# Altium schematic sheet Sche.SchDoc
size A; SheetNumber: 1; SheetTotal: 1
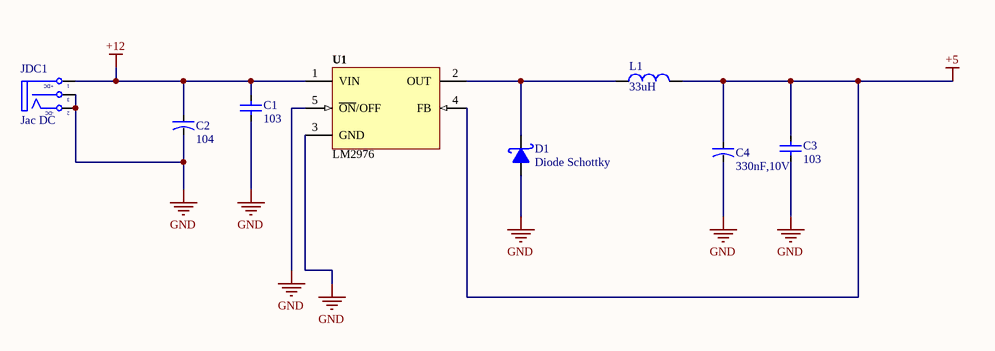
[diagram p0: Sche.SchDoc]

## Parts
C1  103  [CAP_0402]
C2  104  [CA-ALU-2.54]
C3  103  [CAP_0402]
C4  330nF,10V  [CA-ALU-2.54]
D1  Diode Schottky  [DIO-3A]
JDC1  Jac DC  [DC-IN]
L1  33uH  [L-SMD-M-12x10]
U1  LM2976  [TO263-5]

## Nets
+5: C3.1 C4.1 L1.2 U1.4(FB)
+12: C1.2 C2.1 JDC1.1(T) U1.1(VIN)
GND: C1.1 C2.2 C3.2 C4.2 D1.1(A) JDC1.2(TN) JDC1.3(S) U1.3(GND) U1.5(~{ON}/OFF)
NetD1_2: D1.2(K) L1.1 U1.2(OUT)

## Notes on the sheet
- (in symbol DCIN) +DC; -DC

## Library data of the parts
C1 C3 = CapSMD: Capacitor; Value: 33p; Published: 8-Jun-2000; LatestRevisionDate: 17-Jul-2002; LatestRevisionNote: Re-released for DXP Platform.; PackageReference: RAD-0.3; Publisher: Altium Limited
C2 = CAP-ALU-DIP: Capacitor (Semiconductor SIM Model); LatestRevisionDate: 17-Jul-2002; LatestRevisionNote: Re-released for DXP Platform.; PackageReference: C1206; Publisher: Altium Limited; Value: 104
C4 = CAP-ALU-DIP: Capacitor (Semiconductor SIM Model); Value: 104; LatestRevisionDate: 17-Jul-2002; LatestRevisionNote: Re-released for DXP Platform.; PackageReference: C1206; Publisher: Altium Limited
D1 = Diode Schottky: Generic Diode Schottky
JDC1 = DCIN: Jac DC input; Value: Jac DC
L1 = Inductor: Value: 150 mH
U1 = LM2596: Max Input Voltage: 12 V; Max Output Current: 3 (6.0 peak) A; Max Output Voltage: mV; Category: IC-Power; Min Input Voltage: mV; Min Output Voltage: mV; Mounting Technology: Surface Mount; Status: Unreleased; Supply Voltage: mV; Temperature Range: -40 to +125 degC